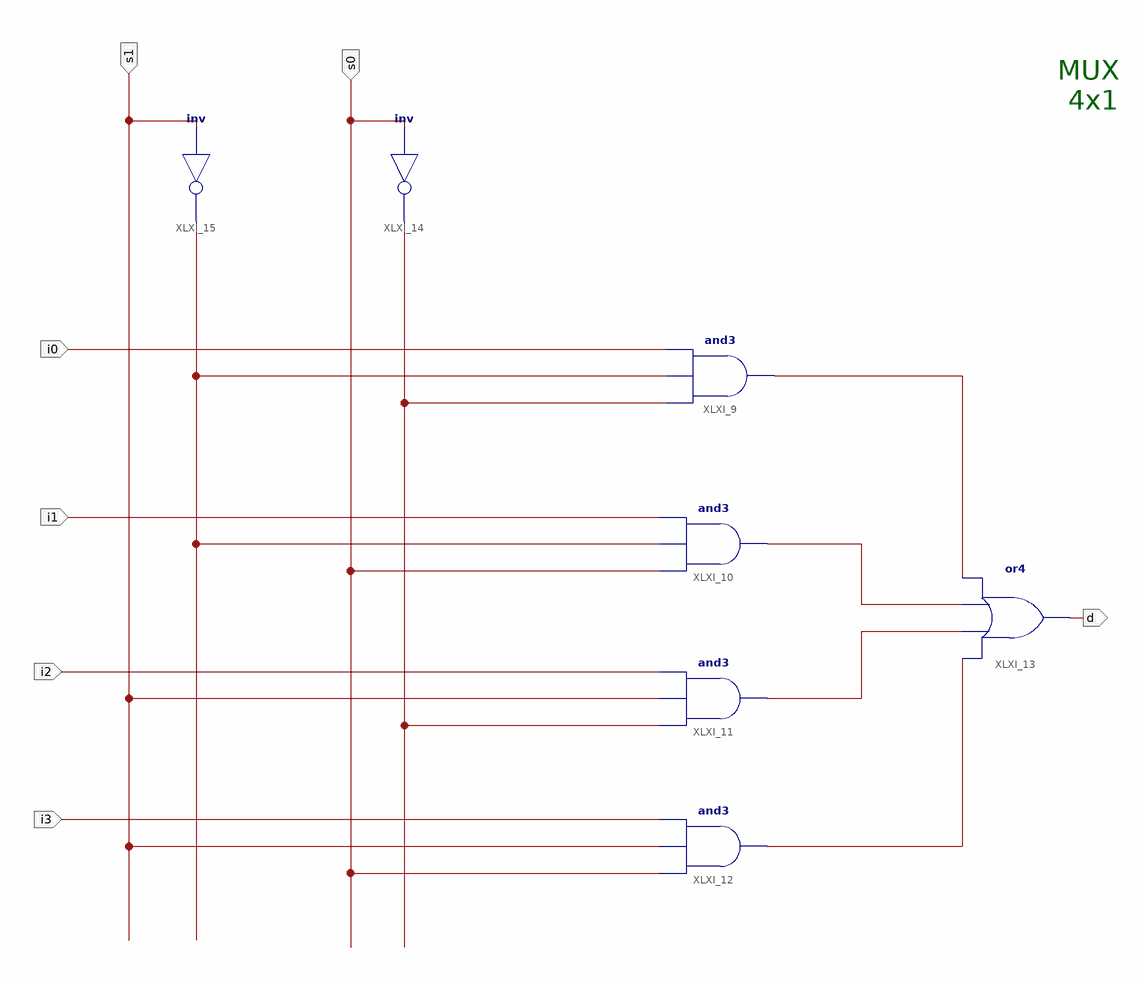
[diagram p0: schematic sheet 1]
// Xilinx ISE schematic mux_circuit.sch (spartan3e) as structural Verilog: 7 symbols, 7 ports
module mux_circuit (
  input  s0,
  input  s1,
  input  i3,
  input  i1,
  input  i0,
  input  i2,
  output d
);

  wire XLXN_8, XLXN_9, XLXN_17, XLXN_18, XLXN_19, XLXN_20;

  and XLXI_9 (XLXN_17, XLXN_9, XLXN_8, i0);
  and XLXI_10 (XLXN_18, s0, XLXN_8, i1);
  and XLXI_11 (XLXN_19, XLXN_9, s1, i2);
  and XLXI_12 (XLXN_20, s0, s1, i3);
  or XLXI_13 (d, XLXN_20, XLXN_19, XLXN_18, XLXN_17);
  not XLXI_14 (XLXN_9, s0);
  not XLXI_15 (XLXN_8, s1);

  // Notes on the sheet:
  //   MUX
  //   4x1
endmodule
